# Altium project 24.063_24.069_HEAT.PrjPCB
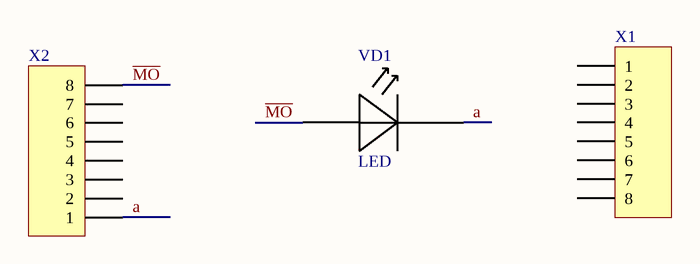
[diagram p0: 24.063_24.069_HEAT.SchDoc]
1 sheet, 3 parts. Net scope: global (net labels, ports and power ports of the same name join across sheets).
Board file: 24.063_24.069_HEAT.PcbDoc

## Sheet 24.063_24.069_HEAT.SchDoc
size A4

### Parts
VD1  LED  [LED 24.063]
X1  Header 8  [HDR1X8]  (value not drawn)
X2  Header 8  [HDR1X8]  (value not drawn)

### Nets
~{MO}: VD1.1 X2.8
a: VD1.2 X2.1

Not connected (* = marked no-connect by the designer): X1 1 2 3 4 5 6 7 8; X2 2 3 4 5 6 7

### Library data of the parts
X1 X2 = Header 8: Header, 8-Pin; LatestRevisionDate: 17-Jul-2002; LatestRevisionNote: Re-released for DXP Platform.; Publisher: Altium Limited